# Altium schematic sheet IO.schdoc
size 297 x 209 mm; Symbol: Drawing-Symbol_A4; @Project Name: Weather-Station; @Page Count: 2; @Update Date: 2026-03-24; @Create Date: 2026-01-05; @Schematic Name: Mainboard; @Page No: 2; @Page Name: IO; Company: EasyEDA.com; Version: V1.0; Page Size: A4; @Create Time: 13:18:56; @Update Time: 14:01:41; Border: 1; Width: 1170; Height: 825; Region Start: 1; X Region Count: 6; Y Region Count: 4; Blade Width: 10; Title Block Position: 3; @Board Name: Mainboard; Device: Drawing-Symbol_A4
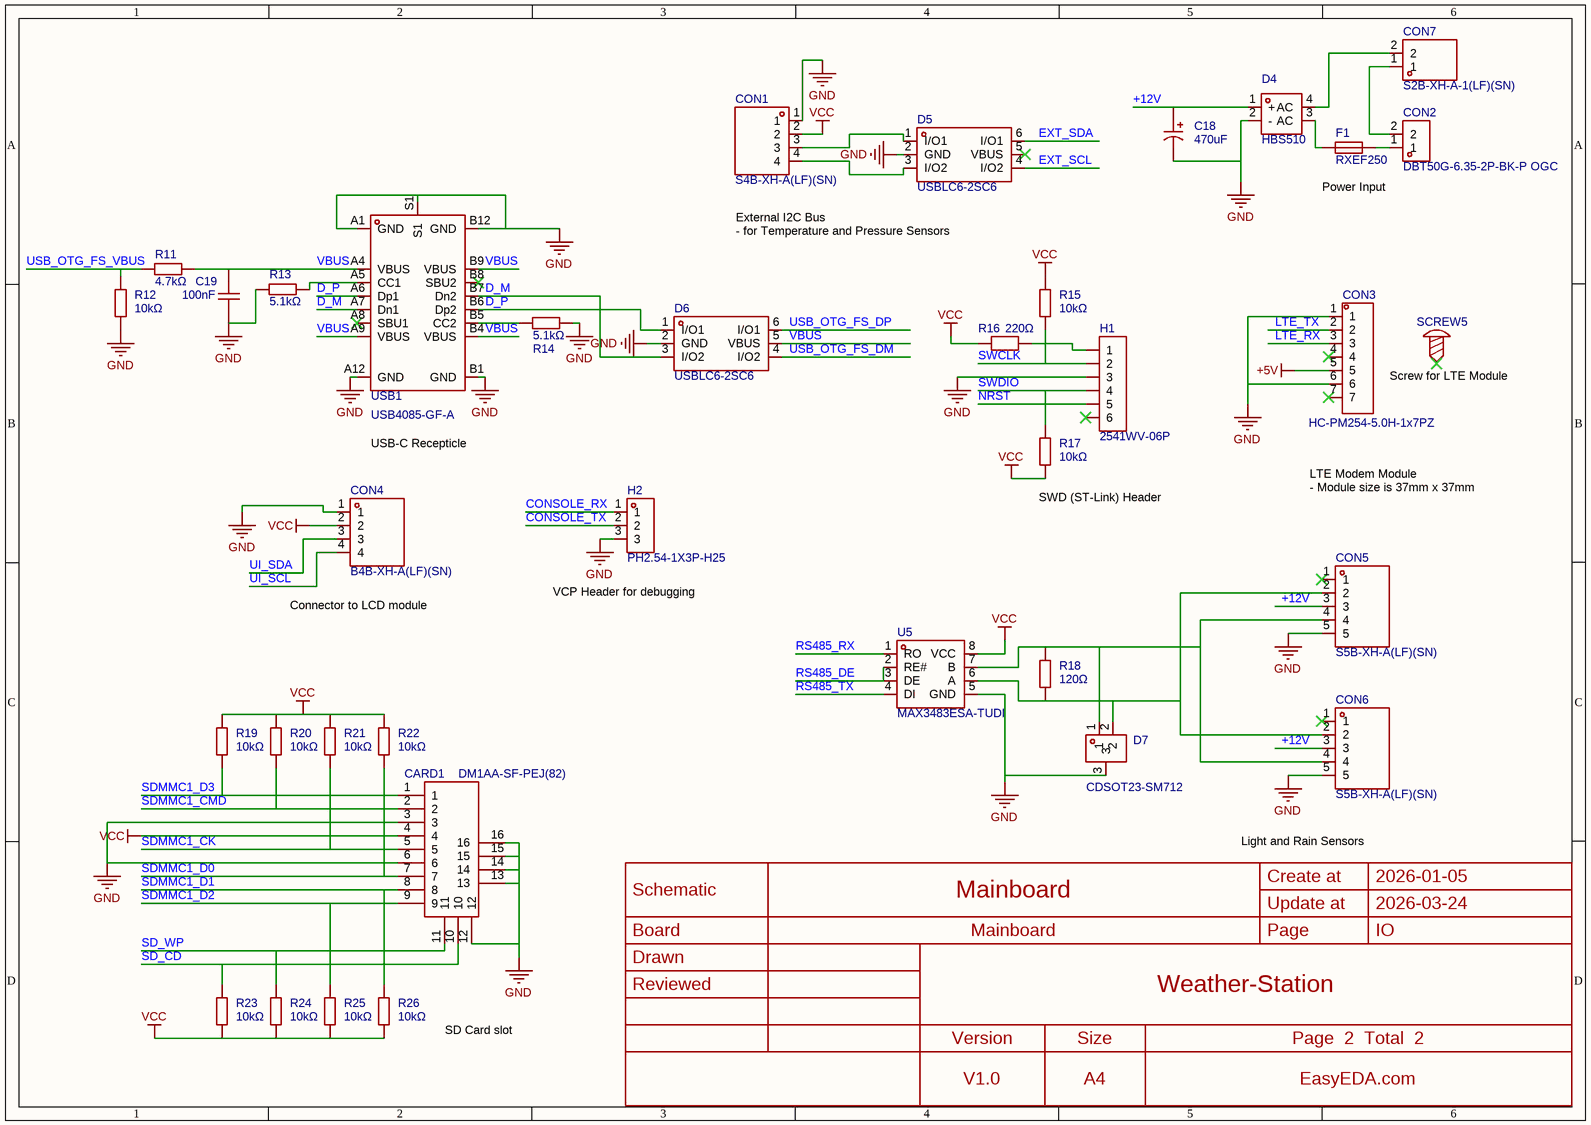
[diagram p0: IO.schdoc]

## Parts
C18  470uF  [CAP-SMD_BD10.0-L10.3-W10.3-LS11.3-FD]
C19  100nF  [C0402]
CARD1  DM1AA-SF-PEJ(82)  [SD-SMD_DM1AA-SF-PEJ-82]
CON1  S4B-XH-A(LF)(SN)  [CONN-TH_S4B-XH-A-LF-SN]
CON2  DBT50G-6.35-2P-BK-P OGC  [CONN-TH_2P-P6.35_DBT50G-6.35-2P-BK-P]
CON3  HC-PM254-5.0H-1x7PZ  [HDR-TH_7P-P2.54-V-M-3]
CON4  B4B-XH-A(LF)(SN)  [CONN-TH_B4B-XH-A-LF-SN]
CON5  S5B-XH-A(LF)(SN)  [CONN-TH_5P-P2.50_S5B-XH-A-LF-SN]
CON6  S5B-XH-A(LF)(SN)  [CONN-TH_5P-P2.50_S5B-XH-A-LF-SN]
CON7  S2B-XH-A-1(LF)(SN)  [CONN-TH_S2B-XH-A-1-LF-SN]
D4  HBS510  [DIO-BG-SMD_4P-L10.2-W7.0-P5.42-LS9.9-TR]
D5  USBLC6-2SC6  [SOT-23-6_L2.9-W1.6-P0.95-LS2.8-BL]
D6  USBLC6-2SC6  [SOT-23-6_L2.9-W1.6-P0.95-LS2.8-BL]
D7  CDSOT23-SM712  [SOT-23-3_L2.9-W1.3-P0.95-LS2.4-BR]
F1  RXEF250  [FUSE-TH_L20.8-W3.0-P10.15-D0.6-S2.10]
H1  2541WV-06P  [HDR-TH_6P-P2.54-V-M]
H2  PH2.54-1X3P-H25  [HDR-TH_3P-P2.54-V-M]
R11  4.7kΩ  [R0402]
R12  10kΩ  [R0402]
R13  5.1kΩ  [R0402]
R14  5.1kΩ  [R0402]
R15  10kΩ  [R0402]
R16  220Ω  [R0402]
R17  10kΩ  [R0402]
R18  120Ω  [R0402]
R19  10kΩ  [R0402]
R20  10kΩ  [R0402]
R21  10kΩ  [R0402]
R22  10kΩ  [R0402]
R23  10kΩ  [R0402]
R24  10kΩ  [R0402]
R25  10kΩ  [R0402]
R26  10kΩ  [R0402]
SCREW5  (no value)  [Screw-Hole-M2]
U5  MAX3483ESA-TUDI  [SOIC-8_L4.9-W3.9-P1.27-LS6.0-BL]
USB1  USB4085-GF-A  [USC-C-SMD_USB4085-GF-A]

## Nets
+5V: CON3.5
GND: C18.2 C19.2 CARD1.3 CARD1.6 CARD1.12 CARD1.13 CARD1.14 CARD1.15 CARD1.16 CON1.1 CON3.1 CON3.6 CON4.1 CON5.5 CON6.5 D4.2(-) D5.2(GND) D6.2(GND) D7.3 H1.3 H2.3 R12.1 R13.1 R14.2 U5.5(GND) USB1.A1(GND) USB1.A12(GND) USB1.B1(GND) USB1.B12(GND) USB1.S1
VCC: CARD1.4 CON1.2 CON4.2 R15.2 R16.1 R17.1 R19.2 R20.2 R21.2 R22.2 R23.1 R24.1 R25.1 R26.1 U5.8(VCC)
+12V: C18.1 CON5.3 CON6.3 D4.1(+)
CONSOLE_RX: H2.1
CONSOLE_TX: H2.2
D_M: D6.3(I/O2) USB1.A7(Dn1) USB1.B7(Dn2)
D_P: D6.1(I/O1) USB1.A6(Dp1) USB1.B6(Dp2)
EXT_SCL: D5.4(I/O2)
EXT_SDA: D5.6(I/O1)
LTE_RX: CON3.3
LTE_TX: CON3.2
NRST: H1.5
RS485_DE: U5.2(RE#) U5.3(DE)
RS485_RX: U5.1(RO)
RS485_TX: U5.4(DI)
SD_CD: CARD1.10 R23.2
SD_WP: CARD1.11 R24.2
SDMMC1_CK: CARD1.5 R21.1
SDMMC1_CMD: CARD1.2 R20.1
SDMMC1_D0: CARD1.7 R22.1
SDMMC1_D1: CARD1.8 R26.2
SDMMC1_D2: CARD1.9 R25.2
SDMMC1_D3: CARD1.1 R19.1
SWCLK: H1.2 R15.1
SWDIO: H1.4 R17.2
UI_SCL: CON4.4
UI_SDA: CON4.3
USB_OTG_FS_DM: D6.4(I/O2)
USB_OTG_FS_DP: D6.6(I/O1)
USB_OTG_FS_VBUS: R11.2 R12.2
VBUS: C19.1 D6.5(VBUS) R11.1 USB1.A4(VBUS) USB1.A9(VBUS) USB1.B4(VBUS) USB1.B9(VBUS)
NetCON1_3: CON1.3 D5.1(I/O1)
NetCON1_4: CON1.4 D5.3(I/O2)
NetCON2_1: CON2.1 F1.2
NetCON2_2: CON2.2 CON7.1
NetCON5_2: CON5.2 CON6.2 D7.2 R18.1 U5.6(A)
NetCON5_4: CON5.4 CON6.4 D7.1 R18.2 U5.7(B)
NetCON7_2: CON7.2 D4.4(AC)
NetD4_3: D4.3(AC) F1.1
NetH1_1: H1.1 R16.2
NetR13_2: R13.2 USB1.A5(CC1)
NetR14_1: R14.1 USB1.B5(CC2)

Not connected (* = marked no-connect by the designer): CON3 4* 7*; CON5 1*; CON6 1*; D5 5(VBUS)*; H1 6*; SCREW5 1*; USB1 A8(SBU1)* B8(SBU2)*

## Notes on the sheet
- (near D6) External I2C Bus
  - for Temperature and Pressure Sensors
- Power Input
- (near SCREW5) Screw for LTE Module
- USB-C Recepticle
- (near CON5) LTE Modem Module
  - Module size is 37mm x 37mm
- (near R17) SWD (ST-Link) Header
- (near CON4) Connector to LCD module
- (near H2) VCP Header for debugging
- Light and Rain Sensors
- SD Card slot
- Create at
- 2026-01-05
- Schematic
- Board
- Mainboard
- Update at
- Page
- 2026-03-24
- IO
- Drawn
- Reviewed
- Weather-Station
- Version
- V1.0
- Size
- A4
- Page  2  Total  2
- EasyEDA.com

## Library data of the parts
C18 = XT470UF35V90RV0080: Capacitance:470uF Tolerance:±20% Tolerance:±20% Voltage Rating:35V Ripple Current:310mA@120Hz Equivalent Series Resistance(ESR):- Diameter:10mm Height - Seated (Max):10.5mm Lifetime:2000hrs@105℃ Operating Temperature:-55℃~+105℃ Operating Temperature:-55℃~; Manufacturer: KNSCHA(科尼盛); Check: true; AddInBom: yes; ModelId: f2896a4c7caf4a2ea3d3e60a40c7e309; ModelTransform: 429.133,405.511,0,180,0,0,0,0,0; Tolerance: ±20%; Voltage Rating: 35V; Symbol: XT470UF35V90RV0080; Device: XT470UF35V90RV0080; LCSC Part Name: 470uF ±20% 35V; SupplierPart: C2992611; ManufacturerPart: XT470UF35V90RV0080; Supplier Footprint: SMD,D10xL10.5mm; JLCPCB Part Class: Extended Part; Datasheet: https://item.szlcsc.com/datasheet/XT470UF35V90RV0080/3457671.html; Supplier: LCSC; ConvertToPcb: yes; FootprintName: CAP-SMD_BD10.0-L10.3-W10.3-LS11.3-FD; ModelName: CAP-SMD_BD10.0-L10.3-W10.3-LS11.3-FD; Value: 470uF; Ripple Current: 310mA@120Hz; Equivalent Series Resistance(ESR): -; Diameter: 10mm; Height - Seated (Max): 10.5mm; Lifetime: 2000hrs@105℃; Operating Temperature: -55℃~+105℃
C19 = CL05B104KO5NNNC: Capacitance:100nF Tolerance:±10% Tolerance:±10% Voltage Rating:16V Temperature Coefficient:X7R; Manufacturer: SAMSUNG(三星); Symbol: CAP; Check: true; AddInBom: yes; ModelId: b7d13df3e9464d7a99d0651d1a5b4d57; ModelName: C0402_L1.0-W0.5-H0.5; ModelTransform: 39.37,19.685,0,0,0,0,0,0,0; Tolerance: ±10%; Voltage Rating: 16V; Temperature Coefficient: X7R; Device: CL05B104KO5NNNC; LCSC Part Name: 100nF ±10% 16V; SupplierPart: C1525; ManufacturerPart: CL05B104KO5NNNC; Supplier Footprint: 0402; JLCPCB Part Class: Basic Part; Datasheet: https://item.szlcsc.com/datasheet/CL05B104KO5NNNC/1877.html; Supplier: LCSC; ConvertToPcb: yes; FootprintName: C0402; Value: 100nF
CARD1 = DM1AA-SF-PEJ(82): Card Connection Mode:Push-Push Card Type:Standard SD Card Connector Type:Connector and Ejector Additional Card Detection Pins:Yes Supplementary Features:With Locating Post Height Above Board:2.9mm Operating Temperature:-25℃~+85℃ Operating Temperature:-25℃; Manufacturer: HRS(广濑); Check: true; AddInBom: yes; ModelId: e2defbd7866b42a3a56317a5d04428d9; ModelTransform: 1181.1,1208.26534,0,90,0,0,97.439,-0.001,-23.622; Symbol: DM1AA-SF-PEJ(82); Device: DM1AA-SF-PEJ(82); LCSC Part Name: 自弹式 标准SD卡 卡座; SupplierPart: C506790; ManufacturerPart: DM1AA-SF-PEJ(82); Supplier Footprint: SMD; JLCPCB Part Class: Extended Part; Datasheet: https://item.szlcsc.com/datasheet/DM1AA-SF-PEJ(82)/519946.html; Supplier: LCSC; ConvertToPcb: yes; FootprintName: SD-SMD_DM1AA-SF-PEJ-82; ModelName: SD-SMD_DM1AA-SF-PEJ-82; Card Connection Mode: Push-Push; Card Type: Standard SD Card; Connector Type: Connector and Ejector; Additional Card Detection Pins: Yes; Supplementary Features: With Locating Post; Height Above Board: 2.9mm; Operating Temperature: -25℃~+85℃
CON1 = S4B-XH-A(LF)(SN): Pins Structure:1x4P Pitch:2.5mm Mounting Type:Right Angle Reference Series:XH Number of Pins:4P Number of Rows:1 Number of PINs Per Row:4 Row Spacing:- Current Rating:3A Contact Material:Brass Contact Plating:Tin Operating Temperature:-25℃~+85℃ Operating; Manufacturer: JST; Check: true; AddInBom: yes; ModelId: 77a2ced4cba941c49e3f4130b9ad2f4f; ModelTransform: 488.19194,452.755,0,180,0,0,0.591,136.378,-133.858; Pins Structure: 1x4P; Pitch: 2.5mm; Reference Series: XH; Number of PINs Per Row: 4; Current Rating: 3A; Voltage Rating: 250V; Plastic Material: PA66; Flame Retardant Rating: UL94V-0; Supplementary Features: K Pin; Z-Height of the Board: 6.1mm; X-Length of Bottom Edge on Board (Spacing Line): 12.4mm; Y-Width of Bottom Edge on Board: 11.5mm; Symbol: S4B-XH-A (LF)(SN); Device: S4B-XH-A(LF)(SN); LCSC Part Name: 1x4P 间距:2.5mm 弯插 系列:XH; SupplierPart: C157925; ManufacturerPart: S4B-XH-A(LF)(SN); Supplier Footprint: 弯插,P=2.5mm; JLCPCB Part Class: Extended Part; Datasheet: https://item.szlcsc.com/datasheet/S4B-XH-A(LF)(SN)/169273.html; Supplier: LCSC; ConvertToPcb: yes; FootprintName: CONN-TH_S4B-XH-A-LF-SN; ModelName: CONN-TH_S4B-XH-A-LF-SN; Mounting Type: Right Angle; Number of Pins: 4P; Number of Rows: 1; Row Spacing: -; Contact Material: Brass; Contact Plating: Tin; Operating Temperature: -25℃~+85℃; Color: White
CON2 = DBT50G-6.35-2P-BK-P OGC: Barrier Type:3-Side Pitch:6.35mm Number of Positions or Pins:1x2P Mounting Type:- Pin Location:Side Mount Number of Pins:2P Number of Rows:1 Number of PINs Per Row:2 Screw Specification:- Current Rating:10A Voltage Rating (Max):300V Wire Gauge - AWG:- Wir; Manufacturer: DORABO(地博电气); AddInBom: yes; ModelId: e6338b06d07a4d0ba8aeb8fc567d70990819f05c4eef4c71ace90d822a990e87; ModelTransform: 558.10912,555,0,0,0,0,0,-110.827,-157.48; Barrier Type: 3-Side; Pitch: 6.35mm; Number of Positions or Pins: 1x2P; Number of PINs Per Row: 2; Current Rating: 10A; Voltage Rating (Max): 300V; Symbol: DBT50G-6.35-2P-BK-P OGC; Device: DBT50G-6.35-2P-BK-P OGC; LCSC Part Name: 6.35mm 1x2P 边脚 排数:1 每排P数:2; SupplierPart: C5179471; ManufacturerPart: DBT50G-6.35-2P-BK-P OGC; Supplier Footprint: 插件,P=6.35mm; JLCPCB Part Class: Extended Part; Datasheet: https://item.szlcsc.com/datasheet/DBT50G-6.35-2P-BK-P%2520OGC/5835646.html; Supplier: LCSC; ConvertToPcb: yes; FootprintName: CONN-TH_2P-P6.35_DBT50G-6.35-2P-BK-P; ModelName: CONN-TH_2P-P6.35_DBT50G-6.35-2P-BK-P; Mounting Type: -; Pin Location: Side Mount; Number of Pins: 2P; Number of Rows: 1; Screw Specification: -; Wire Gauge - AWG: -; Wire Gauge - mm2: -; Operating Temperature: -40℃~+105℃; Color: Black
CON3 = HC-PM254-5.0H-1x7PZ: Holes Structure:1x7P Pitch:2.54mm Row Spacing:- Circular Hole / Square Hole:Square Hole Mounting Type:Through Hole Number of Rows:1 Number of Positions:7P Current Rating:3A Voltage Rating (Max):- Holes Direction:Top Insulation Height:5mm Contact Material:; Manufacturer: HC(虹成电子); Symbol: 220S-1*7P H=8.5MM Ytype Gold-plated; Check: true; AddInBom: yes; ModelId: 044f619d7dee4fdf92305b6d4d413094; ModelTransform: 715.7466,94.8817,0,0,0,0,0,0,-118.11; Holes Structure: 1x7P; Pitch: 2.54mm; Number of Positions: 7P; Current Rating: 3A; Holes Direction: Top; PIN Length: 3mm; Device: HC-PM254-5.0H-1x7PZ; LCSC Part Name: 间距2.54mm 1x7Pin 直插 PC3.0 H5.0; SupplierPart: C27985232; ManufacturerPart: HC-PM254-5.0H-1x7PZ; Supplier Footprint: 插件,P=2.54mm; JLCPCB Part Class: Extended Part; Datasheet: https://item.szlcsc.com/datasheet/HC-PM254-5.0H-1x7PZ/29721190.html; Supplier: LCSC; ConvertToPcb: yes; FootprintName: HDR-TH_7P-P2.54-V-M-3; ModelName: HDR-TH_7P-P2.54-V-M-3; Row Spacing: -; Circular Hole / Square Hole: Square Hole; Mounting Type: Through Hole; Number of Rows: 1; Voltage Rating (Max): -; Insulation Height: 5mm; Contact Material: Brass; Contact Plating: Gold; Operating Temperature: -40℃~+105℃; Supplementary Features: -
CON4 = B4B-XH-A(LF)(SN): Pins Structure:1x4P Pitch:2.5mm Mounting Type:Through Hole Reference Series:XH Number of Pins:4P Number of Rows:1 Number of PINs Per Row:4 Row Spacing:- Current Rating:3A Contact Material:Brass Contact Plating:Tin Operating Temperature:-25℃~+85℃ Operating; Manufacturer: JST; Check: true; AddInBom: yes; ModelId: 3dc2be3da48b4d969f321a0c2c608d12; ModelName: XH2.5-4A; ModelTransform: 492.125,224.44837,0,180,0,0,-0.001,17.716,-98.425; Pins Structure: 1x4P; Pitch: 2.5mm; Reference Series: XH; Number of PINs Per Row: 4; Current Rating: 3A; Voltage Rating: 250V; Plastic Material: PA66; Flame Retardant Rating: UL94V-0; Supplementary Features: K Pin; Z-Height of the Board: 7mm; X-Length of Bottom Edge on Board (Spacing Line): 12.4mm; Y-Width of Bottom Edge on Board: 5.75mm; Symbol: B4B-XH-A(LF)(SN); Device: B4B-XH-A(LF)(SN); LCSC Part Name: 1x4P 间距:2.5mm 直插 系列:XH; SupplierPart: C144395; ManufacturerPart: B4B-XH-A(LF)(SN); Supplier Footprint: 插件,P=2.5mm; JLCPCB Part Class: Extended Part; Datasheet: https://item.szlcsc.com/datasheet/B4B-XH-A(LF)(SN)/155727.html; Supplier: LCSC; ConvertToPcb: yes; FootprintName: CONN-TH_B4B-XH-A-LF-SN; Mounting Type: Through Hole; Number of Pins: 4P; Number of Rows: 1; Row Spacing: -; Contact Material: Brass; Contact Plating: Tin; Operating Temperature: -25℃~+85℃; Color: White
CON5 CON6 = S5B-XH-A(LF)(SN): Pins Structure:1x5P Pitch:2.5mm Mounting Type:Right Angle Reference Series:XH Number of Pins:5P Number of Rows:1 Number of PINs Per Row:5 Row Spacing:- Current Rating:3A Contact Material:Brass Contact Plating:Tin Operating Temperature:-25℃~+85℃ Operating; Manufacturer: JST; Check: true; AddInBom: yes; ModelId: 580a312281304b2bb34c9e10631c48db; ModelTransform: 586.613,452.755,0,0,0,0,-5.109,-122.047,-137.795; Pins Structure: 1x5P; Pitch: 2.5mm; Reference Series: XH; Number of PINs Per Row: 5; Current Rating: 3A; Voltage Rating: 250V; Plastic Material: PA66; Flame Retardant Rating: UL94V-0; Supplementary Features: K Pin; Z-Height of the Board: 6.1mm; X-Length of Bottom Edge on Board (Spacing Line): 14.9mm; Y-Width of Bottom Edge on Board: 11.5mm; Symbol: S5B-XH-A(LF)(SN); Device: S5B-XH-A(LF)(SN); LCSC Part Name: 1x5P 间距:2.5mm 弯插 系列:XH; SupplierPart: C263757; ManufacturerPart: S5B-XH-A(LF)(SN); Supplier Footprint: 弯插,P=2.5mm; JLCPCB Part Class: Extended Part; Datasheet: https://item.szlcsc.com/datasheet/S5B-XH-A(LF)(SN)/254658.html; Supplier: LCSC; ConvertToPcb: yes; FootprintName: CONN-TH_5P-P2.50_S5B-XH-A-LF-SN; ModelName: CONN-TH_5P-P2.50_S5B-XH-A-LF-SN; Mounting Type: Right Angle; Number of Pins: 5P; Number of Rows: 1; Row Spacing: -; Contact Material: Brass; Contact Plating: Tin; Operating Temperature: -25℃~+85℃; Color: White
CON7 = S2B-XH-A-1(LF)(SN): Pins Structure:1x2P Pitch:2.5mm Mounting Type:Right Angle Reference Series:XH Number of Pins:2P Number of Rows:1 Number of PINs Per Row:2 Row Spacing:- Current Rating:3A Contact Material:Brass Contact Plating:Tin Operating Temperature:-25℃~+85℃ Operating; Manufacturer: JST; AddInBom: yes; ModelId: eafca4ee50fd493bb05686c038515a650819f05c4eef4c71ace90d822a990e87; ModelTransform: 291.338,452.755,0,0,0,0,0.394,73.43,-129.921; Pins Structure: 1x2P; Pitch: 2.5mm; Reference Series: XH; Number of PINs Per Row: 2; Current Rating: 3A; Voltage Rating: 250V; Plastic Material: PA66; Flame Retardant Rating: UL94V-0; Supplementary Features: K Pin; Z-Height of the Board: 6.1mm; X-Length of Bottom Edge on Board (Spacing Line): 7.4mm; Y-Width of Bottom Edge on Board: 11.5mm; Symbol: S2B-XH-A-1 (LF)(SN); Device: S2B-XH-A-1(LF)(SN); LCSC Part Name: 1x2P 间距:2.5mm 弯插 系列:XH; SupplierPart: C163035; ManufacturerPart: S2B-XH-A-1(LF)(SN); Supplier Footprint: 弯插,P=2.5mm; JLCPCB Part Class: Extended Part; Datasheet: https://item.szlcsc.com/datasheet/S2B-XH-A-1(LF)(SN)/174416.html; Supplier: LCSC; ConvertToPcb: yes; FootprintName: CONN-TH_S2B-XH-A-1-LF-SN; ModelName: CONN-TH_S2B-XH-A-1-LF-SN; Mounting Type: Right Angle; Number of Pins: 2P; Number of Rows: 1; Row Spacing: -; Contact Material: Brass; Contact Plating: Tin; Operating Temperature: -25℃~+85℃; Color: White
D4 = HBS510: Voltage - Forward(Vf@If):1V@5A Voltage - DC Reverse(Vr):1kV Current - Rectified:5A Reverse Leakage Current (Ir):5uA@1000V Non-Repetitive Peak Forward Surge Current:150A Operating Junction Temperature Range:-55℃~+150℃ Operating Junction Temperature Range:-; Manufacturer: GOODWORK(固得沃克); AddInBom: yes; Voltage - Forward(Vf@If): 1V@5A; Voltage - DC Reverse(Vr): 1kV; Current - Rectified: 5A; Non-Repetitive Peak Forward Surge Current: 150A; Type: Single-Phase Rectifier; Symbol: HBS510; Device: HBS510; LCSC Part Name: 耐压:1000V 电流:5A; SupplierPart: C6067507; ManufacturerPart: HBS510; Supplier Footprint: HBS; Datasheet: https://item.szlcsc.com/datasheet/HBS510/7007031.html; Supplier: LCSC; ConvertToPcb: yes; FootprintName: DIO-BG-SMD_4P-L10.2-W7.0-P5.42-LS9.9-TR; Reverse Leakage Current (Ir): 5uA@1000V; Operating Junction Temperature Range: -55℃~+150℃
D5 D6 = USBLC6-2SC6_C2687116: Maximum Clamping Voltage:15V Breakdown Voltage:6V Number of Lines:双路 Type:ESD; Manufacturer: UMW(友台半导体); Check: true; AddInBom: yes; ModelId: 1370be37a17e44418ae52e2b4cc1f5e5; ModelName: SOT-23-6_L2.9-W1.6-H1.5-LS2.8-P0.95; ModelTransform: 110.236,113.364,0,90,0,0,0.0005,0.0005,0; Maximum Clamping Voltage: 15V; Breakdown Voltage: 6V; Number of Lines: 双路; Type: ESD; Symbol: USBLC6-2SC6_C2687116; Device: USBLC6-2SC6_C2687116; LCSC Part Name: USBLC6-2SC6; SupplierPart: C2687116; ManufacturerPart: USBLC6-2SC6; Supplier Footprint: SOT-23-6; JLCPCB Part Class: Extended Part; Datasheet: https://atta.szlcsc.com/upload/public/pdf/source/20231109/512642D850D9873E7C519F71E85B9A10.pdf; Supplier: LCSC; ConvertToPcb: yes; FootprintName: SOT-23-6_L2.9-W1.6-P0.95-LS2.8-BL
D7 = CDSOT23-SM712: Polarity:Bidirectional Reverse Stand-Off Voltage (Vrwm):12V；7V Clamping Voltage:12V；26V Peak Pulse Current (Ipp):17A Peak Pulse Power Dissipation (Ppp):400W Voltage - Breakdown:7.5V；13.3V Reverse Leakage Current (Ir):50nA；2uA Number of Channels:2 Operatin; Manufacturer: TECH PUBLIC(台舟); Symbol: CDSOT23-SM712_C5122012; Check: true; AddInBom: yes; ModelId: 62a57c6760504a01965db6419a6d07df; ModelName: SOT-23-3P_L2.9-W1.3-H1.0-LS2.4-P0.95; ModelTransform: 98.425,114.173,0,180,0,0,0.0005,-0.0005,0; Reverse Stand-Off Voltage (Vrwm): 12V；7V; Peak Pulse Current (Ipp): 17A; Peak Pulse Power Dissipation (Ppp): 400W; Number of Channels: 2; level of protection: IEC 61000-4-2；IEC 61000-4-4；IEC 61000-4-5; Type: ESD; Device: CDSOT23-SM712; LCSC Part Name: CDSOT23-SM712; SupplierPart: C5122012; ManufacturerPart: CDSOT23-SM712; Supplier Footprint: SOT-23; JLCPCB Part Class: Extended Part; Datasheet: https://item.szlcsc.com/datasheet/CDSOT23-SM712/5710598.html; Supplier: LCSC; ConvertToPcb: yes; FootprintName: SOT-23-3_L2.9-W1.3-P0.95-LS2.4-BR; Polarity: Bidirectional; Clamping Voltage: 12V；26V; Voltage - Breakdown: 7.5V；13.3V; Reverse Leakage Current (Ir): 50nA；2uA; Operating Temperature: -55℃~+125℃; Junction Capacitance: -
F1 = RXEF250: Voltage - Max:72V Current - Max:40A Hold Current:2.5A Trip Current:5A Power Dissipation:2.5W Resistance - Initial (Ri) (Min):50mΩ Resistance - Post Trip (R1) (Max):130mΩ Time to Trip(Max):15.6s Operating Temperature:-40℃~+85℃ Operating Temperature:-40℃~+8; Manufacturer: Littelfuse(美国力特); AddInBom: yes; ModelId: e7daf8e578b3483f8c982f8085e4c9290819f05c4eef4c71ace90d822a990e87; ModelTransform: 818.896,122.01865,0,0,0,0,-0.002,0.001,-137.795; Voltage - Max: 72V; Current - Max: 40A; Hold Current: 2.5A; Trip Current: 5A; Power Dissipation: 2.5W; Resistance - Initial (Ri) (Min): 50mΩ; Resistance - Post Trip (R1) (Max): 130mΩ; Time to Trip(Max): 15.6s; Symbol: RXEF250; Device: RXEF250; LCSC Part Name: 72V 2.5A; SupplierPart: C2760162; ManufacturerPart: RXEF250; Supplier Footprint: 插件,P=10mm; JLCPCB Part Class: Extended Part; Datasheet: https://item.szlcsc.com/datasheet/RXEF250/2880526.html; Supplier: LCSC; ConvertToPcb: yes; FootprintName: FUSE-TH_L20.8-W3.0-P10.15-D0.6-S2.10; ModelName: FUSE-TH_L20.8-W3.0-P10.15-D0.6-S2.10; Operating Temperature: -40℃~+85℃; Length: 20.8mm; Width: -; Height: -; Pitch: -
H1 = 2541WV-06P: Pin Structure:1x6P Pitch:2.54mm Circluar Pins/Square Pins:Pin Header Mounting Type:Through Hole Number of Rows:1 Number of Pins:6P Length of Mating Pin:6mm Insulation Height:2.54mm Length of End Connection Pin:3mm Contact Plating:Gold Operating Temperatur; Manufacturer: HanElectricity(瀚源); Symbol: Header-Male-2.54_1x6; Check: true; AddInBom: yes; ModelId: 6ebb80f5681945ec9fb368fbc217c3f7; ModelName: HDR-TH_6P-P2.54-M-LI-1X6P; ModelTransform: 590.1563,98.425,0,0,0,0,0,0,-118.11; Pin Structure: 1x6P; Pitch: 2.54mm; Device: 2541WV-06P; LCSC Part Name: 1x6P 间距:2.54mm 方针 直插; SupplierPart: C5383115; ManufacturerPart: 2541WV-06P; Supplier Footprint: 插件,P=2.54mm; JLCPCB Part Class: Extended Part; Datasheet: https://item.szlcsc.com/datasheet/2541WV-06P/6258475.html; Supplier: LCSC; ConvertToPcb: yes; FootprintName: HDR-TH_6P-P2.54-V-M; Circluar Pins/Square Pins: Pin Header; Mounting Type: Through Hole; Number of Rows: 1; Number of Pins: 6P; Length of Mating Pin: 6mm; Insulation Height: 2.54mm; Length of End Connection Pin: 3mm; Contact Plating: Gold; Operating Temperature: -55℃~+105℃
H2 = PH2.54-1X3P-H25: Pin Structure:1x3P Pitch:2.54mm Row Spacing:- Circluar Pins/Square Pins:Pin Header Mounting Type:Through Hole Number of Rows:1 Number of Pins:3P Current Rating:3A Voltage Rating (Max):- Length of Mating Pin:6mm Insulation Height:2.5mm Length of End Connec; Manufacturer: JXTCONN(聚兴泰); Symbol: PZ254V-11-03P_C2937625; Check: true; AddInBom: yes; ModelId: b83490ae987a4919a987f9b45fc060bc; ModelName: HDR-TH_3P-P2.54-M-LI-1X3P; ModelTransform: 300.03877,100,0,0,0,0,0,0,-118.11; Pin Structure: 1x3P; Pitch: 2.54mm; Current Rating: 3A; Device: PH2.54-1X3P-H25; LCSC Part Name: 1x3P 间距:2.54mm 方针 直插; SupplierPart: C42431836; ManufacturerPart: PH2.54-1X3P-H25; Supplier Footprint: 插件,P=2.54mm; JLCPCB Part Class: Extended Part; Datasheet: https://item.szlcsc.com/datasheet/PH2.54-1X3P-H25/44458966.html; Supplier: LCSC; ConvertToPcb: yes; FootprintName: HDR-TH_3P-P2.54-V-M; Row Spacing: -; Circluar Pins/Square Pins: Pin Header; Mounting Type: Through Hole; Number of Rows: 1; Number of Pins: 3P; Voltage Rating (Max): -; Length of Mating Pin: 6mm; Insulation Height: 2.5mm; Length of End Connection Pin: 3mm; Contact Material: Brass; Contact Plating: Gold; Operating Temperature: -40℃~+105℃; Color: Black
R11 = 0402WGF4701TCE: Type:Thick Film Resistor Resistance:4.7kΩ Tolerance:±1% Tolerance:±1% Power(Watts):62.5mW Voltage-Supply(Max):50V Temperature Coefficient:±100ppm/℃ Temperature Coefficient:±100ppm/℃ Operating Temperature:-55℃~+155℃ Operating Temperature:-55℃~+155℃; Manufacturer: UNI-ROYAL(厚声); Symbol: Res; Check: true; AddInBom: yes; ModelId: efdecb7dae4442949d28eecaf748420f; ModelName: R0402_L1.0-W0.5-H0.4; ModelTransform: 39.37,19.685,0,0,0,0,0,0,0; Tolerance: ±1%; Power(Watts): 62.5mW; Voltage-Supply(Max): 50V; Device: 0402WGF4701TCE; LCSC Part Name: 4.7kΩ ±1% 62.5mW 厚膜电阻; SupplierPart: C25900; ManufacturerPart: 0402WGF4701TCE; Supplier Footprint: 0402; JLCPCB Part Class: Basic Part; Datasheet: https://item.szlcsc.com/datasheet/0402WGF4701TCE/26643.html; Supplier: LCSC; ConvertToPcb: yes; FootprintName: R0402; Type: Thick Film Resistor; Value: 4.7kΩ; Temperature Coefficient: ±100ppm/℃; Operating Temperature: -55℃~+155℃
R12 R15 R17 R19-R26 = SCR0402F10K: Type:Thick Film Resistor Resistance:10kΩ Tolerance:±1% Tolerance:±1% Power(Watts):62.5mW Voltage-Supply(Max):50V Operating Temperature:-55℃~+155℃ Operating Temperature:-55℃~+155℃; Manufacturer: VO(翔胜); Symbol: Res; Check: true; AddInBom: yes; ModelId: efdecb7dae4442949d28eecaf748420f; ModelName: R0402_L1.0-W0.5-H0.4; ModelTransform: 39.37,19.685,0,0,0,0,0,0,0; Tolerance: ±1%; Power(Watts): 62.5mW; Voltage-Supply(Max): 50V; Device: SCR0402F10K; LCSC Part Name: 厚膜电阻 10kΩ ±1% 62.5mW; SupplierPart: C3015825; ManufacturerPart: SCR0402F10K; Supplier Footprint: 0402; JLCPCB Part Class: Extended Part; Datasheet: https://item.szlcsc.com/datasheet/SCR0402F10K/3528279.html; Supplier: LCSC; ConvertToPcb: yes; FootprintName: R0402; Type: Thick Film Resistor; Value: 10kΩ; Operating Temperature: -55℃~+155℃
R13 R14 = 0402WGF5101TCE: Type:Thick Film Resistor Resistance:5.1kΩ Tolerance:±1% Tolerance:±1% Power(Watts):62.5mW Voltage-Supply(Max):50V Temperature Coefficient:±100ppm/℃ Temperature Coefficient:±100ppm/℃ Operating Temperature:-55℃~+155℃ Operating Temperature:-55℃~+155℃; Manufacturer: UNI-ROYAL(厚声); Symbol: Res; Check: true; AddInBom: yes; ModelId: efdecb7dae4442949d28eecaf748420f; ModelName: R0402_L1.0-W0.5-H0.4; ModelTransform: 39.37,19.685,0,0,0,0,0,0,0; Tolerance: ±1%; Power(Watts): 62.5mW; Voltage-Supply(Max): 50V; Device: 0402WGF5101TCE; LCSC Part Name: 5.1kΩ ±1% 62.5mW 厚膜电阻; SupplierPart: C25905; ManufacturerPart: 0402WGF5101TCE; Supplier Footprint: 0402; JLCPCB Part Class: Basic Part; Datasheet: https://item.szlcsc.com/datasheet/0402WGF5101TCE/26648.html; Supplier: LCSC; ConvertToPcb: yes; FootprintName: R0402; Type: Thick Film Resistor; Value: 5.1kΩ; Temperature Coefficient: ±100ppm/℃; Operating Temperature: -55℃~+155℃
R16 = FRC0402F2200TS: Type:Thick Film Resistor Resistance:220Ω Tolerance:±1% Tolerance:±1% Power(Watts):62.5mW Voltage-Supply(Max):50V Temperature Coefficient:±100ppm/℃ Temperature Coefficient:±100ppm/℃ Operating Temperature:-55℃~+155℃ Operating Temperature:-55℃~+155℃; Manufacturer: FOJAN(富捷); Check: true; AddInBom: yes; ModelId: efdecb7dae4442949d28eecaf748420f; ModelName: R0402_L1.0-W0.5-H0.4; ModelTransform: 39.37,19.685,0,0,0,0,0,0,0; Tolerance: ±1%; Power(Watts): 62.5mW; Voltage-Supply(Max): 50V; Symbol: FRC0402F2200TS; Device: FRC0402F2200TS; LCSC Part Name: 220Ω ±1% 62.5mW 厚膜电阻; SupplierPart: C2909336; ManufacturerPart: FRC0402F2200TS; Supplier Footprint: 0402; JLCPCB Part Class: Extended Part; Datasheet: https://item.szlcsc.com/datasheet/FRC0402F2200TS/3186271.html; Supplier: LCSC; ConvertToPcb: yes; FootprintName: R0402; Type: Thick Film Resistor; Value: 220Ω; Temperature Coefficient: ±100ppm/℃; Operating Temperature: -55℃~+155℃
R18 = 0402WGF1200TCE: Type:Thick Film Resistor Resistance:120Ω Tolerance:±1% Tolerance:±1% Power(Watts):62.5mW Voltage-Supply(Max):50V Temperature Coefficient:±100ppm/℃ Temperature Coefficient:±100ppm/℃ Operating Temperature:-55℃~+155℃ Operating Temperature:-55℃~+155℃; Manufacturer: UNI-ROYAL(厚声); Symbol: Res; Check: true; AddInBom: yes; ModelId: efdecb7dae4442949d28eecaf748420f; ModelName: R0402_L1.0-W0.5-H0.4; ModelTransform: 39.37,19.685,0,0,0,0,0,0,0; Tolerance: ±1%; Power(Watts): 62.5mW; Voltage-Supply(Max): 50V; Device: 0402WGF1200TCE; LCSC Part Name: 120Ω ±1% 62.5mW 厚膜电阻; SupplierPart: C25079; ManufacturerPart: 0402WGF1200TCE; Supplier Footprint: 0402; JLCPCB Part Class: Basic Part; Datasheet: https://item.szlcsc.com/datasheet/0402WGF1200TCE/25822.html; Supplier: LCSC; ConvertToPcb: yes; FootprintName: R0402; Type: Thick Film Resistor; Value: 120Ω; Temperature Coefficient: ±100ppm/℃; Operating Temperature: -55℃~+155℃
SCREW5 = Screw-Hole-M2: Add into BOM: no; Check: true; ConvertToPcb: yes; Device: Screw-Hole-M2; SymbolName: Screw-Hole; Supplier Footprint: 插件; FootprintName: Screw-Hole-M2
U5 = MAX3483ESA-TUDI: Manufacturer: TD(钍地半导体); AddInBom: yes; ModelId: 2ec1ac1bf9bf4d09a988fcee15e6a02d; ModelName: SOIC-8_L4.9-W3.9-H1.7-LS6.0-P1.27; ModelTransform: 192.913,236.22,0,0,0,0,0,0,0; Symbol: MAX3483ESA-TUDI; Device: MAX3483ESA-TUDI; LCSC Part Name: MAX3483ESA-TUDI; SupplierPart: C53286180; ManufacturerPart: MAX3483ESA-TUDI; Supplier Footprint: SOP-8; JLCPCB Part Class: Extended Part; Datasheet: https://item.szlcsc.com/datasheet/MAX3483ESA-TUDI/56360531.html; Supplier: LCSC; ConvertToPcb: yes; FootprintName: SOIC-8_L4.9-W3.9-P1.27-LS6.0-BL
USB1 = USB4085-GF-A_C7095263: Connector Type:Type-C Protocol Standard:USB 2.0 Gender:Female Mounting Type:Right Angle Number of Ports:1 Current Rating-Power:5A Voltage Rating:48V Detection color:Black Operating Temperature:-40℃~+85℃ Operating Temperature:-40℃~+85℃; Manufacturer: GCT; Check: true; AddInBom: yes; ModelId: c8aeed87482b4c2dbfe324ee9a994a20; ModelTransform: 351.9678,361.023,0,0,0,0,0,-71.85,-86.614; Connector Type: Type-C; Protocol Standard: USB 2.0; Gender: Female; Number of Ports: 1; Current Rating-Power: 5A; Voltage Rating: 48V; Detection color: Black; Symbol: USB4085-GF-A_C7095263; Device: USB4085-GF-A_C7095263; LCSC Part Name: Type-C 母 弯插; SupplierPart: C7095263; ManufacturerPart: USB4085-GF-A; Supplier Footprint: 插件; JLCPCB Part Class: Extended Part; Datasheet: https://item.szlcsc.com/datasheet/USB4085-GF-A/8061907.html; Supplier: LCSC; ConvertToPcb: yes; FootprintName: USC-C-SMD_USB4085-GF-A; ModelName: USC-C-SMD_USB4085-GF-A; Mounting Type: Right Angle; Operating Temperature: -40℃~+85℃